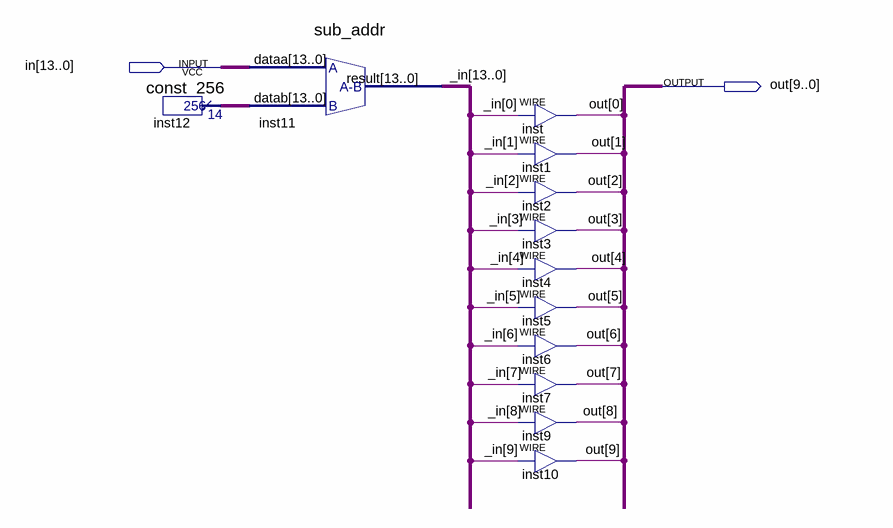
[diagram p0: schematic sheet]
// Quartus schematic bus_14_to_10.bdf as structural Verilog: 12 symbols, 2 pins
module bus_14_to_10 (
  input  [13:0] in,
  output [9:0] out
);

  wire [13:0] _in, inst12_result;

  const_256 inst12 (.result(inst12_result));
  sub_addr inst11 (.dataa(in), .datab(inst12_result), .result(_in));
  assign out[0] = _in[0];  // WIRE inst
  assign out[1] = _in[1];  // WIRE inst1
  assign out[2] = _in[2];  // WIRE inst2
  assign out[3] = _in[3];  // WIRE inst3
  assign out[4] = _in[4];  // WIRE inst4
  assign out[5] = _in[5];  // WIRE inst5
  assign out[6] = _in[6];  // WIRE inst6
  assign out[7] = _in[7];  // WIRE inst7
  assign out[8] = _in[8];  // WIRE inst9
  assign out[9] = _in[9];  // WIRE inst10
endmodule
